# EAGLE design HamLargeV2 (EAGLE 5.11)
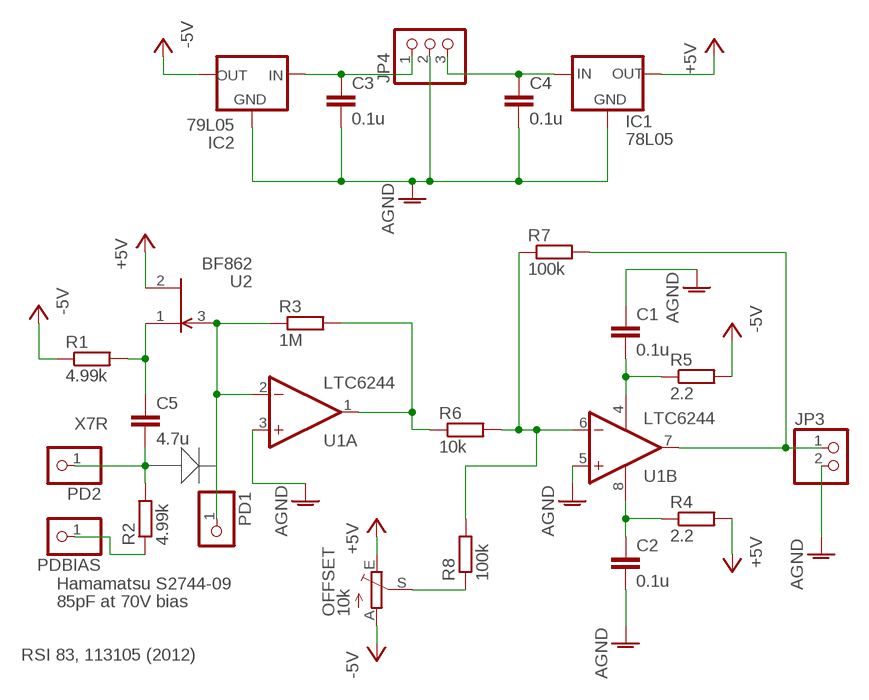
[diagram p0: schematic, sheet 1]

## Parts
C1  0.1u  C-EU025-030X050  [C025-030X050]
C2  0.1u  C-EU025-030X050  [C025-030X050]
C3  0.1u  C-EU025-030X050  [C025-030X050]
C4  0.1u  C-EU025-030X050  [C025-030X050]
C5  4.7u  C-EU050-025X075  [C050-025X075]
IC1  78L05  78LXX  [78LXX]
IC2  79L05  79LXX  [79LXX]
JP3  PINHD-1X2  [1X02]
JP4  PINHD-1X3  [1X03]
OFFSET  10k  TRIM_EU-B90P  [SP19L]
PD1  PINHD-1X1  [1X01]
PD2  PINHD-1X1  [1X01]
PDBIAS  PINHD-1X1  [1X01]
R1  4.99k  R-EU_0204/7  [0204/7]
R2  4.99k  R-EU_0204/7  [0204/7]
R3  1M  R-EU_0204/7  [0204/7]
R4  2.2  R-EU_0204/7  [0204/7]
R5  2.2  R-EU_0204/7  [0204/7]
R6  10k  R-EU_0204/7  [0204/7]
R7  100k  R-EU_0204/7  [0204/7]
R8  100k  R-EU_0204/7  [0204/7]
U1  LTC6244  [MSOP08]
U2  BF862  [SOT23]

## Nets
+5V: IC1.OUT OFFSET.E R4.2 U2.2(D)
-5V: IC2.OUT OFFSET.A R1.1 R5.2
AGND: C1.1 C2.2 C3.2 C4.2 IC1.GND IC2.GND JP3.2 JP4.2 U1.3(A:+IN) U1.5(B:+IN)
N$1: PDBIAS.1 R2.1
N$2: C5.2 PD2.1 R2.2
N$3: C5.1 R1.2 U2.1(S)
N$4: PD1.1 R3.1 U1.2(A:-IN) U2.3(G)
N$6: C3.1 IC2.IN JP4.1
N$7: C4.1 IC1.IN JP4.3
N$9: R3.2 R6.1 U1.1(A:OUT)
N$10: C1.2 R5.1 U1.4(B:V-)
N$11: JP3.1 R7.2 U1.7(B:OUT)
N$12: C2.1 R4.1 U1.8(B:V+)
N$13: R6.2 R7.1 R8.2 U1.6(B:-IN)
N$15: OFFSET.S R8.1

## Notes on the sheet
- X7R
- Hamamatsu S2744-09
- 85pF at 70V bias
- RSI 83, 113105 (2012)

## Library data of the parts
C1-C5 = rcl:C-EU: CAPACITOR, European symbol
IC1 = v-reg:78LXX: VOLTAGE REGULATOR
IC2 = v-reg:79LXX: VOLTAGE REGULATOR
JP3 = pinhead:PINHD-1X2: PIN HEADER
JP4 = pinhead:PINHD-1X3: PIN HEADER
OFFSET = pot:TRIM_EU-: POTENTIOMETER
PD1 PD2 PDBIAS = pinhead:PINHD-1X1: PIN HEADER
R1-R8 = rcl:R-EU_: RESISTOR, European symbol
U1 = custom_parts:LTC6244: Dual 50MHz, low noise, rail-to-rail, CMOS op amp
U2 = custom_parts:BF862: Silicon n-channel symmetric junction field effect transistor

## Board
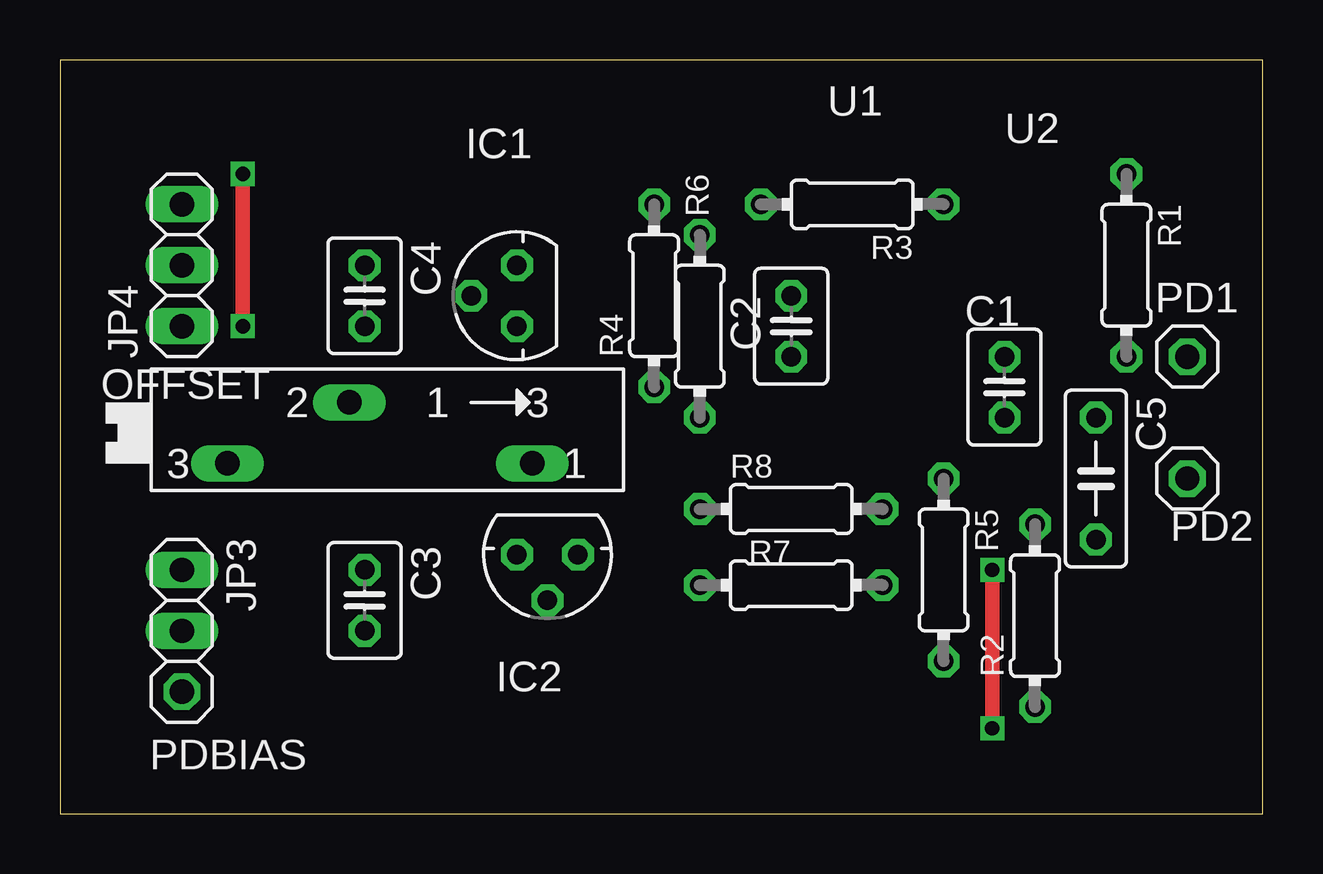
[diagram p1: board, top side]
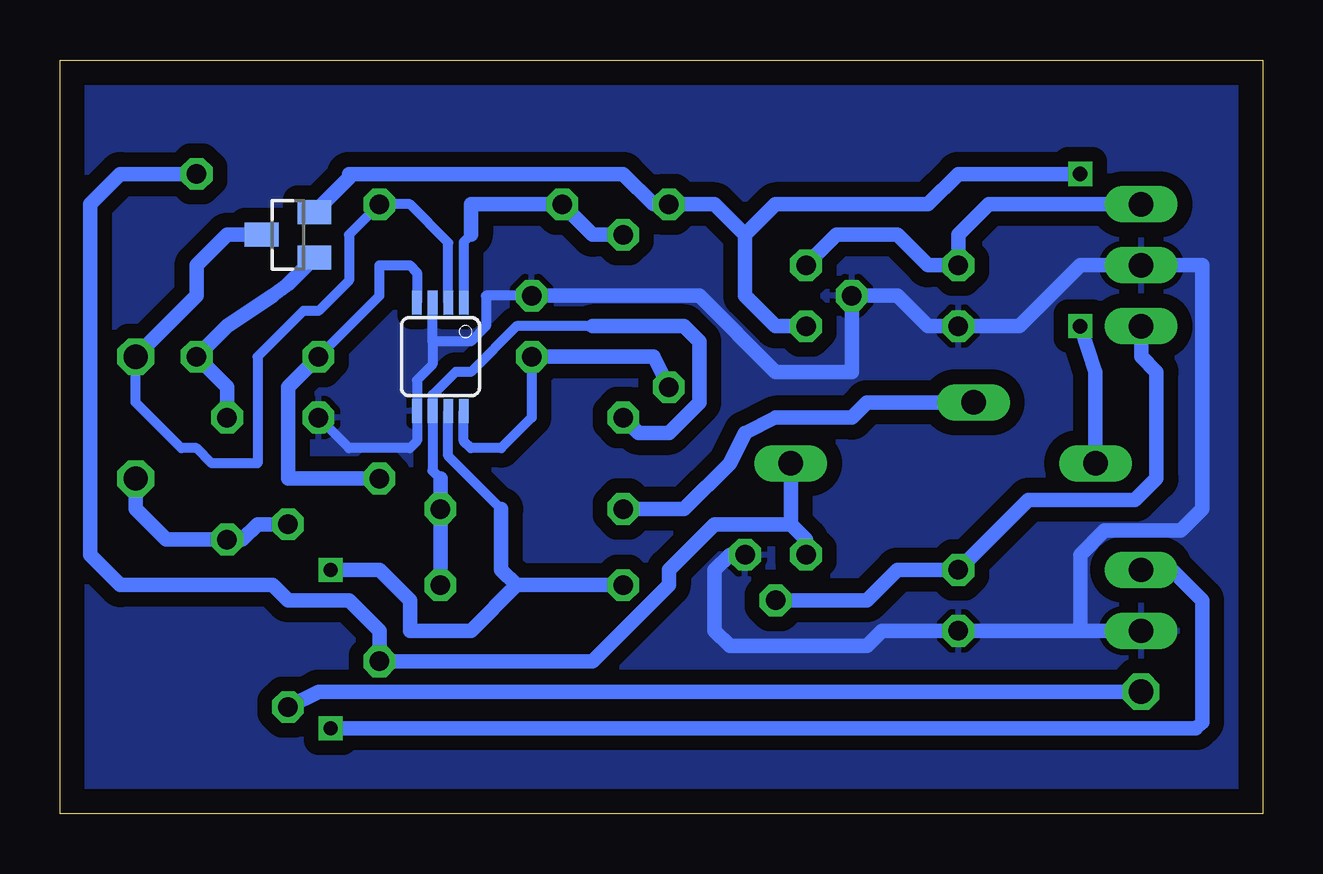
[diagram p2: board, bottom side, seen from below]

Size 50.15 x 31.42 mm. Coordinates in mm from the lower left corner, seen from the top.
Outline: 0,0 50.15,0 50.15,31.42 0,31.42 0,0
Copper layers (1*16): Top 0.035mm / dielectric 1.5mm / Bottom 0.035mm
Design rules "default": minimum track width 10mil, minimum drill 24mil, track to track 8mil, track to pad 8mil, pad to pad 8mil, via to via 8mil, smd to smd 8mil, copper to edge 40mil, drill to drill 8mil, minimum pad ring 10mil, minimum via ring 8mil, stop-mask expansion 4mil, vias tented up to drill 0mil, thermal gap 10mil

### Footprints (pad centres in the part's own frame; a part is rotated, then mirrored left to right if it is on the bottom)
C025-030X050 = drill 0.813 octagon: 1 -1.27,0; 2 1.27,0
C050-025X075 = drill 0.813 octagon: 1 -2.54,0; 2 2.54,0
78LXX = drill 0.813 octagon: GND 0,1.905; IN 1.27,0; OUT -1.27,0
79LXX = drill 0.813 octagon: GND -1.27,0; IN 0,1.905; OUT 1.27,0
1X02 = drill 1.016 long: 1 -1.27,0; 2 1.27,0
1X03 = drill 1.016 long: 1 -2.54,0; 2 0,0; 3 2.54,0
SP19L = drill 1.016 long: A 5.715,-1.27; E -6.985,-1.27; S -1.905,1.27
1X01 = drill 1.016 octagon: 1 0,0
0204/7 = drill 0.813 octagon: 1 -3.81,0; 2 3.81,0
MSOP08 = smd 0.4 x 1: 1 -0.976,-2.263; 2 -0.326,-2.263; 3 0.324,-2.263; 4 0.974,-2.263; 5 0.974,2.262; 6 0.324,2.262; 7 -0.326,2.262; 8 -0.976,2.262
SOT23 = smd 1 x 1.4: 1 -0.95,-1.1; 2 0.95,-1.1; 3 0,1.1

### Placement (x,y rotation side)
C1  39.37,17.78 90 top
C2  30.48,20.32 90 top
C3  12.7,8.89 270 top
C4  12.7,21.59 270 top
C5  43.18,13.97 270 top
IC1  19.05,21.59 90 top
IC2  20.32,10.79 180 top
JP3  5.08,8.89 270 top
JP4  5.08,22.86 90 top
OFFSET  13.97,15.88 0 top
PD1  46.99,19.05 0 top
PD2  46.99,13.97 0 top
PDBIAS  5.08,5.08 0 top
R1  44.45,22.86 270 top
R2  40.64,8.26 90 top
R3  33.02,25.4 180 top
R4  24.77,21.59 90 top
R5  36.83,10.16 270 top
R6  26.67,20.32 270 top
R7  30.48,9.53 180 top
R8  30.48,12.7 0 top
U1  34.29,19.05 180 bottom
U2  40.64,24.13 90 bottom

### Tracks (layer width: path | path; a pad name or v marks a point on that pad's centre or on a via)
+5V  (via drill 0.6)
  Top 0.61: v7.62,20.32 v7.62,26.67
  Bottom 0.61: IC1.OUT 20.32,20.32 21.59,21.59 21.59,24.13 | 21.59,24.13 22.86,25.4 R4.2 25.4,25.4 26.67,26.67 38.1,26.67 38.1,26.52 U2.2 | OFFSET.E 6.98,18.41 v7.62,20.32 | v7.62,26.67 12.7,26.67 13.97,25.4 20.32,25.4 21.59,24.13
-5V
  Bottom 0.61: 19.68,12.06 OFFSET.A | 19.68,12.06 19.05,11.43 IC2.OUT | R1.1 47.62,26.67 48.9,25.4 48.9,10.79 47.62,9.53 41.28,9.53 40.64,8.89 38.1,8.89 36.83,7.62 R5.2 27.94,6.35 24.77,9.53 24.77,10.16 22.86,12.06 19.68,12.06
AGND
  Bottom 0.406: 34.61,19.68 34.61,18.73 35.26,18.08 U1.5 35.26,15.54 35.56,15.24 38.1,15.24 C1.1 | 34.61,19.68 U1.3 | 34.61,19.68 33.02,19.68 32.38,20.32 32.38,21.59 C2.2
  Bottom 0.61: C2.2 23.5,21.59 20.32,18.41 17.14,18.41 IC1.GND 15.24,21.59 13.97,20.32 C4.2 10.16,20.32 7.62,22.86 JP4.2 2.54,22.86 2.54,12.7 3.43,11.81 6.6,11.81 7.62,10.79 7.62,7.62 | IC2.GND 22.22,10.79 22.86,10.16 22.86,7.62 22.22,6.98 16.51,6.98 15.88,7.62 C3.2 7.62,7.62 | JP3.2 7.62,7.62
  pour Bottom (isolate 0.61): 0,0.64 0,31.11 50.17,31.11 49.53,0.64
N$1
  Bottom 0.61: PDBIAS.1 39.37,5.08 R2.1
N$2
  Bottom 0.61: PD2.1 46.99,12.7 45.72,11.43 C5.2 42.55,11.43 41.91,12.06 R2.2
N$3
  Bottom 0.61: C5.1 43.18,17.78 R1.2 43.18,20.32 41.28,21.59 40.64,22.08 U2.1
N$4
  Bottom 0.406: U1.2 33.96,23.8 35.56,25.4 R3.1 38.1,24.13 38.1,22.22 39.37,20.95 40.01,20.95 41.91,19.05 41.91,14.61 43.82,14.61 44.45,15.24 45.09,15.24 46.99,17.14 PD1.1
  Bottom 0.61: U2.3 43.18,24.13 44.45,22.86 44.45,21.59 PD1.1
N$6
  Bottom 0.61: IC2.IN 16.51,8.89 15.24,10.16 C3.1 9.78,13.08 5.33,13.08 4.45,13.97 4.45,18.41 5.08,19.05 JP4.1
N$7
  Bottom 0.61: JP4.3 11.43,25.4 12.7,24.13 C4.1 13.97,22.86 15.24,24.13 17.78,24.13 IC1.IN
N$9
  Bottom 0.406: U1.1 33.31,23.84 33.02,24.13
  Bottom 0.61: R6.1 27.94,24.13 R3.2 33.02,25.4 33.02,24.13
N$10
  Bottom 0.406: U1.4 35.26,22.56 35.56,22.86 36.83,22.86 36.83,21.59 C1.2
  Bottom 0.61: R5.1 40.64,13.97 40.64,17.78 C1.2
N$11  (via drill 0.6)
  Top 0.61: v38.86,3.56 v38.86,10.16
  Bottom 0.406: U1.7 33.96,14.91 31.75,12.7
  Bottom 0.61: 31.75,12.7 31.75,10.16 31.11,9.53 | 31.11,9.53 R7.2 | 31.11,9.53 33.02,7.62 35.56,7.62 35.56,8.89 36.83,10.16 v38.86,10.16 | v38.86,3.56 2.79,3.56 2.54,3.81 2.54,8.89 3.81,10.16 JP3.1
N$12
  Bottom 0.406: U1.8 33.31,15.53 33.02,15.24 31.75,15.24 30.48,16.51 C2.1
  Bottom 0.61: R4.1 25.4,19.05 C2.1
N$13
  Bottom 0.406: 34.29,13.97 34.61,14.29 U1.6 34.61,17.46 33.66,18.41 33.02,18.41 31.11,20.32 27.94,20.32
  Bottom 0.61: 27.94,20.32 24.13,20.32 23.5,19.68 23.5,17.14 24.77,15.88 26.04,15.88 R6.2 | 34.29,13.97 R8.2 R7.1
N$15
  Bottom 0.61: OFFSET.S 16.51,17.14 17.14,16.51 20.32,16.51 21.59,15.88 22.22,14.61 24.13,12.7 R8.1